# Altium project Fingerboard.PrjPcb
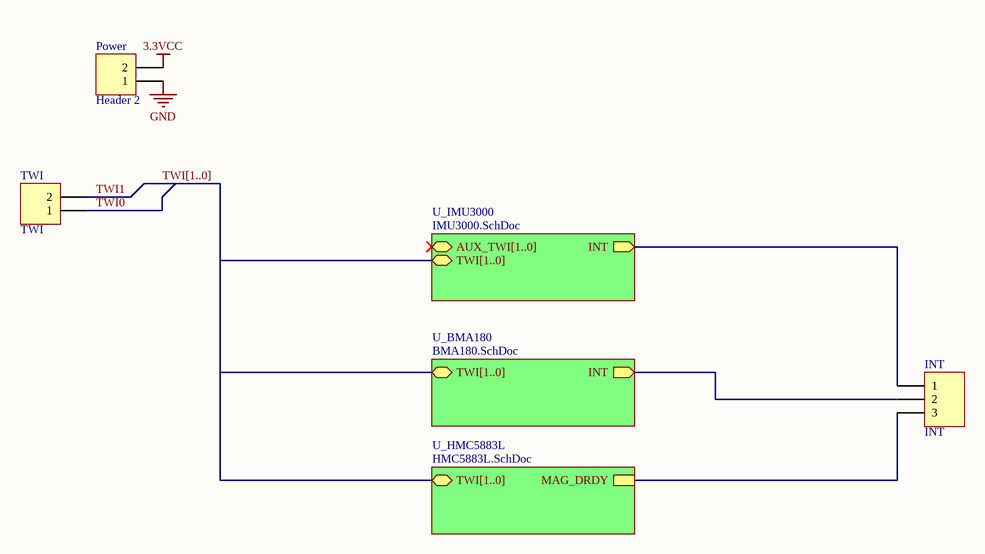
[diagram p0: Fingerboard.SchDoc]
4 sheets, 13 parts. Net scope: hierarchical (ports join the sheet entries above them; power ports are global).
Board files: Fingerboardv5_Commerical_China.PcbDoc, Fingerboardv5_eceshop.PcbDoc, Fingerboardv4.PcbDoc, Fingerboardv2_forcommercial.PcbDoc, Fingerboardv3.PcbDoc, Fingerboardv2.PcbDoc
Sheets:
  Fingerboard.SchDoc
    U_BMA180 = BMA180.SchDoc
    U_HMC5883L = HMC5883L.SchDoc
    U_IMU3000 = IMU3000.SchDoc

## Sheet Fingerboard.SchDoc: Finger Board
size Letter; CheckedBy: 1; Author: Jianer Shi; DrawnBy: Jianer Shi; Engineer: Jianer Shi, Borui Chen; Revision: 1; CurrentDate: 9/20/2011; DocumentName: Finger Board; ModifiedDate: 9/20/2011; ProjectName: 3D Mouse

### Parts
INT  INT  [HDR1X3]
Power  Header 2  [HDR1X2]
TWI  TWI  [HDR1X2]

### Sub-sheets
U_BMA180 = BMA180.SchDoc: INT (out), TWI[1..0] (bidir)
U_HMC5883L = HMC5883L.SchDoc: TWI[1..0] (bidir), MAG_DRDY
U_IMU3000 = IMU3000.SchDoc: INT (out), AUX_TWI[1..0] (bidir), TWI[1..0] (bidir)

### Nets
3.3VCC: Power.2
GND: Power.1
TWI0: TWI.1
TWI1: TWI.2
NetAccel_4: INT.2 ; sheet U_BMA180/INT
NetGyro_12: INT.1 ; sheet U_IMU3000/INT
NetINT_3: INT.3 ; sheet U_HMC5883L/MAG_DRDY

### Buses and harness runs
bus TWI[1..0] = sheet U_BMA180/TWI[1..0] = sheet U_HMC5883L/TWI[1..0] = sheet U_IMU3000/TWI[1..0]

### Notes on the sheet
- Title
- Size:
- Date:
- Letter
- Number:
- Time:
- Revision:
- Sheet
- of
- File:

### Library data of the parts
INT = Header 3: Header, 3-Pin; LatestRevisionDate: 17-Jul-2002; LatestRevisionNote: Re-released for DXP Platform.; Publisher: Altium Limited
Power TWI = Header 2: Header, 2-Pin; LatestRevisionDate: 17-Jul-2002; LatestRevisionNote: Re-released for DXP Platform.; Publisher: Altium Limited

## Sheet BMA180.SchDoc: BMA180
size Letter
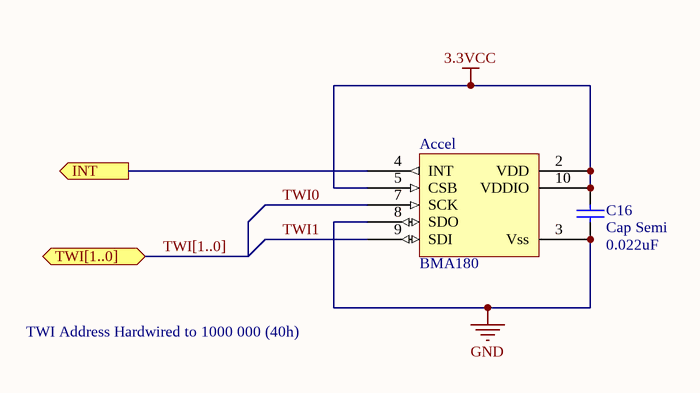
[diagram p1: BMA180.SchDoc]

### Parts
Accel  BMA180  [BMA180 - ECESHOP]
C16  Cap Semi  value 0.022uF  [CAPC2012N]

### Ports
INT (out), TWI[1..0] (bidir)

### Nets
3.3VCC: Accel.2(VDD) Accel.5(CSB) Accel.10(VDDIO) C16.2
GND: Accel.3(Vss) Accel.8(SDO) C16.1
TWI0: Accel.7(SCK)
TWI1: Accel.9(SDI)
NetAccel_4: Accel.4(INT) ; port INT

### Buses and harness runs
bus TWI[1..0] = port TWI[1..0]

### Notes on the sheet
- TWI Address Hardwired to 1000 000 (40h)
- Title
- Size:
- Date:
- Letter
- Number:
- Time:
- Revision:
- Sheet
- of
- File:

### Library data of the parts
C16 = Cap Semi: Capacitor (Semiconductor SIM Model); Published: 8-Jun-2000; LatestRevisionDate: 29-May-2009; LatestRevisionNote: IPC-7351 Footprint Added.; PackageReference: C1206; Publisher: Altium Limited; PackageDescription: Chip Capacitor

## Sheet HMC5883L.SchDoc: HMC5883L
size Letter
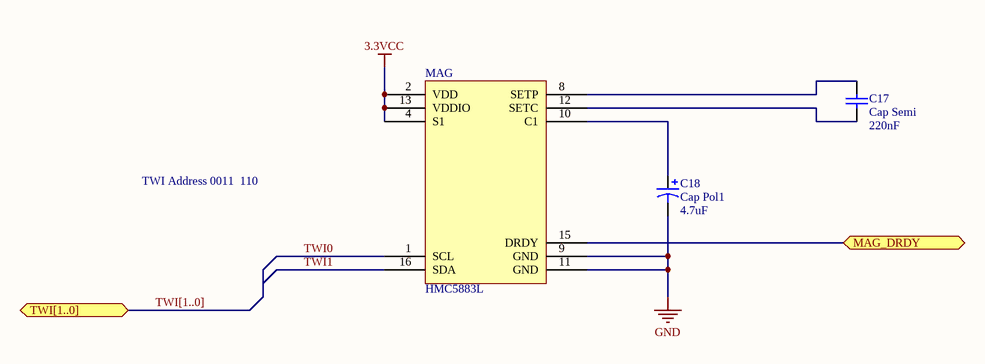
[diagram p2: HMC5883L.SchDoc]

### Parts
C17  Cap Semi  value 220nF  [CAPC2012N]
C18  Cap Pol1  value 4.7uF  [TC3528-1411]
MAG  HMC5883L  [HMC5883L - ECESHOP]

### Ports
MAG_DRDY, TWI[1..0] (bidir)

### Nets
3.3VCC: MAG.2(VDD) MAG.4(S1) MAG.13(VDDIO)
GND: C18.2 MAG.9(GND) MAG.11(GND)
TWI0: MAG.1(SCL)
TWI1: MAG.16(SDA)
NetC17_1: C17.1 MAG.8(SETP)
NetC17_2: C17.2 MAG.12(SETC)
NetC18_1: C18.1 MAG.10(C1)
NetINT_3: MAG.15(DRDY) ; port MAG_DRDY

Not connected (* = marked no-connect by the designer): MAG 3(NC) 5(NC) 6(NC) 7(NC) 14(NC)

### Buses and harness runs
bus TWI[1..0] = port TWI[1..0]

### Notes on the sheet
- TWI Address 0011  110
- Title
- Size:
- Date:
- Letter
- Number:
- Time:
- Revision:
- Sheet
- of
- File:

### Library data of the parts
C17 = Cap Semi: Capacitor (Semiconductor SIM Model); Published: 8-Jun-2000; LatestRevisionDate: 29-May-2009; LatestRevisionNote: IPC-7351 Footprint Added.; PackageReference: C1206; Publisher: Altium Limited; PackageDescription: Chip Capacitor
C18 = Cap Pol1: Polarized Capacitor (Radial); Published: 8-Jun-2000; LatestRevisionDate: 17-Jul-2002; LatestRevisionNote: Re-released for DXP Platform.; PackageReference: RB7.6-15; Publisher: Altium Limited; PackageDescription: Polarized Capacitor (Radial); 2 Leads

## Sheet IMU3000.SchDoc: IMU 3000
size Letter
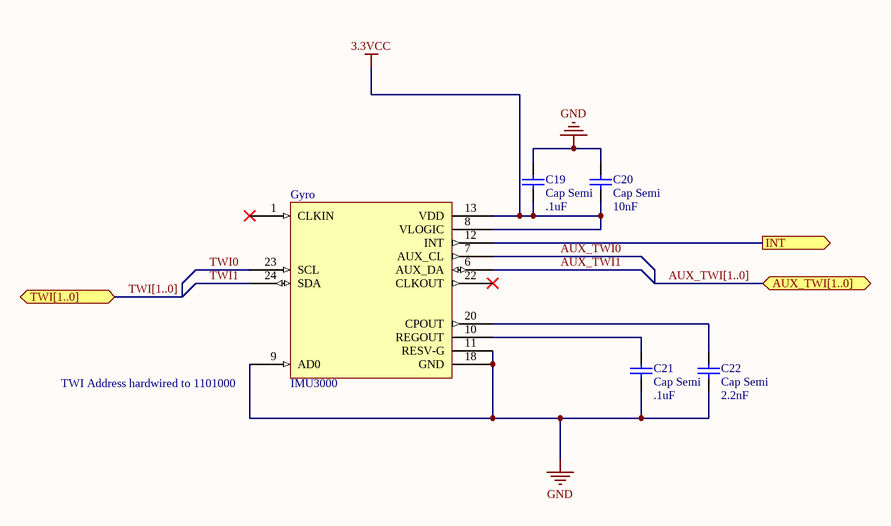
[diagram p3: IMU3000.SchDoc]

### Parts
C19  Cap Semi  value .1uF  [CAPC2012N]
C20  Cap Semi  value 10nF  [CAPC2012N]
C21  Cap Semi  value .1uF  [CAPC2012N]
C22  Cap Semi  value 2.2nF  [CAPC2012N]
Gyro  IMU3000  [IMU3000 - ECESHOP]

### Ports
AUX_TWI[1..0] (bidir), INT (out), TWI[1..0] (bidir)

### Nets
3.3VCC: C19.2 C20.2 Gyro.8(VLOGIC) Gyro.13(VDD)
GND: C19.1 C20.1 C21.1 C22.1 Gyro.9(AD0) Gyro.11(RESV-G) Gyro.18(GND)
AUX_TWI0: Gyro.7(AUX_CL)
AUX_TWI1: Gyro.6(AUX_DA)
TWI0: Gyro.23(SCL)
TWI1: Gyro.24(SDA)
NetC21_2: C21.2 Gyro.10(REGOUT)
NetC22_2: C22.2 Gyro.20(CPOUT)
NetGyro_12: Gyro.12(INT) ; port INT

Not connected (* = marked no-connect by the designer): Gyro 1(CLKIN)* 22(CLKOUT)*

### Buses and harness runs
bus AUX_TWI[1..0] = port AUX_TWI[1..0]
bus TWI[1..0] = port TWI[1..0]

### Notes on the sheet
- (near Gyro) TWI Address hardwired to 1101000
- Title
- Size:
- Date:
- Letter
- Number:
- Time:
- Revision:
- Sheet
- of
- File:

### Library data of the parts
C19-C22 = Cap Semi: Capacitor (Semiconductor SIM Model); Published: 8-Jun-2000; LatestRevisionDate: 29-May-2009; LatestRevisionNote: IPC-7351 Footprint Added.; PackageReference: C1206; Publisher: Altium Limited; PackageDescription: Chip Capacitor

## Nets that join several sheets
3.3VCC: Fingerboard (Power.2), BMA180 (Accel.2 Accel.5 Accel.10 C16.2), HMC5883L (MAG.2 MAG.4 MAG.13), IMU3000 (C19.2 C20.2 Gyro.8 Gyro.13)
GND: Fingerboard (Power.1), BMA180 (Accel.3 Accel.8 C16.1), HMC5883L (C18.2 MAG.9 MAG.11), IMU3000 (7 pins)
NetAccel_4: Fingerboard (INT.2), BMA180 (Accel.4)
NetGyro_12: Fingerboard (INT.1), IMU3000 (Gyro.12)
NetINT_3: Fingerboard (INT.3), HMC5883L (MAG.15)
TWI0: Fingerboard (TWI.1), BMA180 (Accel.7), HMC5883L (MAG.1), IMU3000 (Gyro.23)
TWI1: Fingerboard (TWI.2), BMA180 (Accel.9), HMC5883L (MAG.16), IMU3000 (Gyro.24)